# Altium schematic sheet PWM Fan Speed Controller.SchDoc
size A
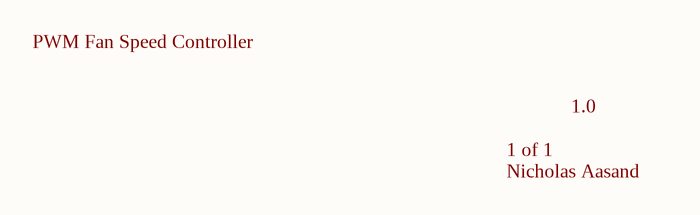
[diagram p0: PWM Fan Speed Controller.SchDoc]

## Notes on the sheet
- PWM Fan Speed Controller
- 1 of 1
- 1.0
- Nicholas Aasand